# EAGLE design dice (EAGLE 9.6.0)
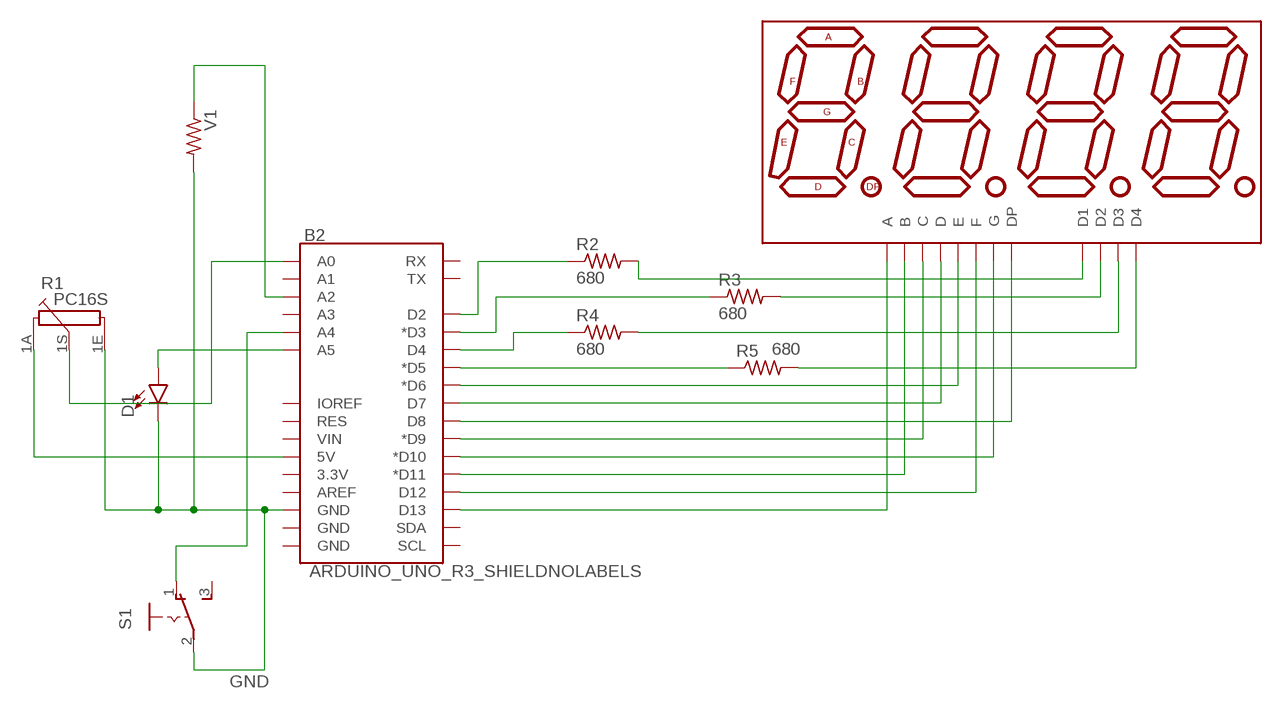
[diagram p0: schematic, sheet 1]

## Parts
B2  ARDUINO_UNO_R3_SHIELDNOLABELS  [UNO_R3_SHIELD_NOLABELS]
D1  LED5MM  [LED_5MM]
DISP1  ATA8041AB  7-SEGMENT-4DIGIT-20MM-BLUE  [7-SEGMENT-4DIGIT-20MM]
R1  PC16S  [PC16S]
R2  680  R-US_0204/7  [0204/7]
R3  680  R-US_0204/7  [0204/7]
R4  680  R-US_0204/7  [0204/7]
R5  680  R-US_0204/7  [0204/7]
S1  255SB  [255SB]
V1  R-US_0414/15  [0414/15]

## Nets
A: B2.D13 DISP1.11(A)
B: B2.D11(*D11) DISP1.7(B)
C: B2.D9(*D9) DISP1.4(C)
D: B2.D7 DISP1.2(D)
D1: DISP1.12(D1) R2.2
D1G: B2.D2 R2.1
D2: DISP1.9(D2) R3.2
D2G: B2.D3(*D3) R3.1
D3: DISP1.8(D3) R4.2
D3G: B2.D4 R4.1
D4: DISP1.6(D4) R5.2
D4G: B2.D5(*D5) R5.1
DP: B2.D8 DISP1.3(DP)
E: B2.D6(*D6) DISP1.1(E)
F: B2.D12 DISP1.10(F)
G: B2.D10(*D10) DISP1.5(G)
GND: B2.GND@2(GND) D1.K(C) R1.1E S1.2(P) V1.2
LED: B2.A5 D1.A
POT: B2.A0 R1.1S
SW: B2.A4 S1.1(O)
VCC: B2.5V R1.1A
VIBR: B2.A2 V1.1
Unconnected: B2.3.3V B2.A1 B2.A3 B2.AREF B2.GND@0(GND) B2.GND@1(GND) B2.IOREF B2.RES B2.RX B2.SCL B2.SDA B2.TX B2.VIN S1.3(S)

## Library data of the parts
B2 = SparkFun-Boards-mtr:ARDUINO_UNO_R3_SHIELD: Arduino R3 Shield Footprint Shield form compatible with the Arduino Uno R3. SparkFun Products: MG2639 Cellular Shield <https://www.sparkfun.com/products/13120> MIDI Shield <https://www.sparkfun.com/products/12898> R3 Stackable Headers Kit <https://www.sparkfun.com/products/11417>
D1 = SparkFun-LED:LED: LED (Generic) Standard schematic elements and footprints for 5mm, 3mm, 1206, and 0603 sized LEDs. Generic LEDs with no color specified.
DISP1 = SparkFun-LED-mtr:7-SEGMENT-4DIGIT-20MM: 4 Digit 7 Segment Display This is a part for the 4-Digit 7-segment LEDs from Young Sun. Different from the Digikey LEDs, all 16 pins are used. The LONGPADS Variant is used for a test jig, but you may like it because there is more pad to solder to. If you are concerned about routing space, the standard works just fine though. Datasheets: Red <http://cdn.sparkfun.com/datasheets/Components/LED/1LEDREDCC.pdf> Yellow <http://cdn.sparkfun.com/datasheets/Components/LED/1LEDYELCC.pdf> Green <http://cdn.sparkfun.com/datasheets/Components/LED/1LEDGRNCC.pdf> Blue <http://cdn.sparkfun.com/datasheets/Components/LED/1LEDBLUCC.pdf> White <http://cdn.sparkfun.com/datasheets/Components/LED/1LEDWHTCC.pdf> SparkFun Products Raw Components 7-Segment Display - 20mm (Red) <https://www.sparkfun.com/products/11405> (COM-11405) 7-Segment Display - 20mm (Yellow) <https://www.sparkfun.com/products/11406> (COM-11406) 7-Segment Display - 20mm (Green) <https://www.sparkfun.com/products/11407> (COM-11407) 7-Segment Display - 20mm (Blue) <https://www.sparkfun.com/products/11408> (COM-11408) 7-Segment Display - 20mm (White) <https://www.sparkfun.com/products/11409> (COM-11409) Serial Controlled SparkFun OpenSegment Serial Display - 20mm (Red) <https://www.sparkfun.com/products/11644> (COM-11644) SparkFun OpenSegment Serial Display - 20mm (Yellow) <https://www.sparkfun.com/products/11645> (COM-11645) SparkFun OpenSegment Serial Display - 20mm (Green) <https://www.sparkfun.com/products/11646> (COM-11646) SparkFun OpenSegment Serial Display - 20mm (Blue) <https://www.sparkfun.com/products/11647> (COM-11647) SparkFun OpenSegment Serial Display - 20mm (White) <https://www.sparkfun.com/products/11648> (COM-11648) Other SparkFun OpenSegment Shield <https://www.sparkfun.com/products/13190> (DEV-13190); PROD_ID: COMP-11446
R1 = piher:PC16S: POTENTIOMETER single carbon potentiometer, 16 mm, S3ROH; OC_FARNELL: 4452940; OC_NEWARK: unknown
R2-R5 V1 = rcl:R-US_: RESISTOR, American symbol; SPICEPREFIX: R
S1 = switch:255SB: SLIDING SWITCH Distributor Buerklin, 11G810

## Board
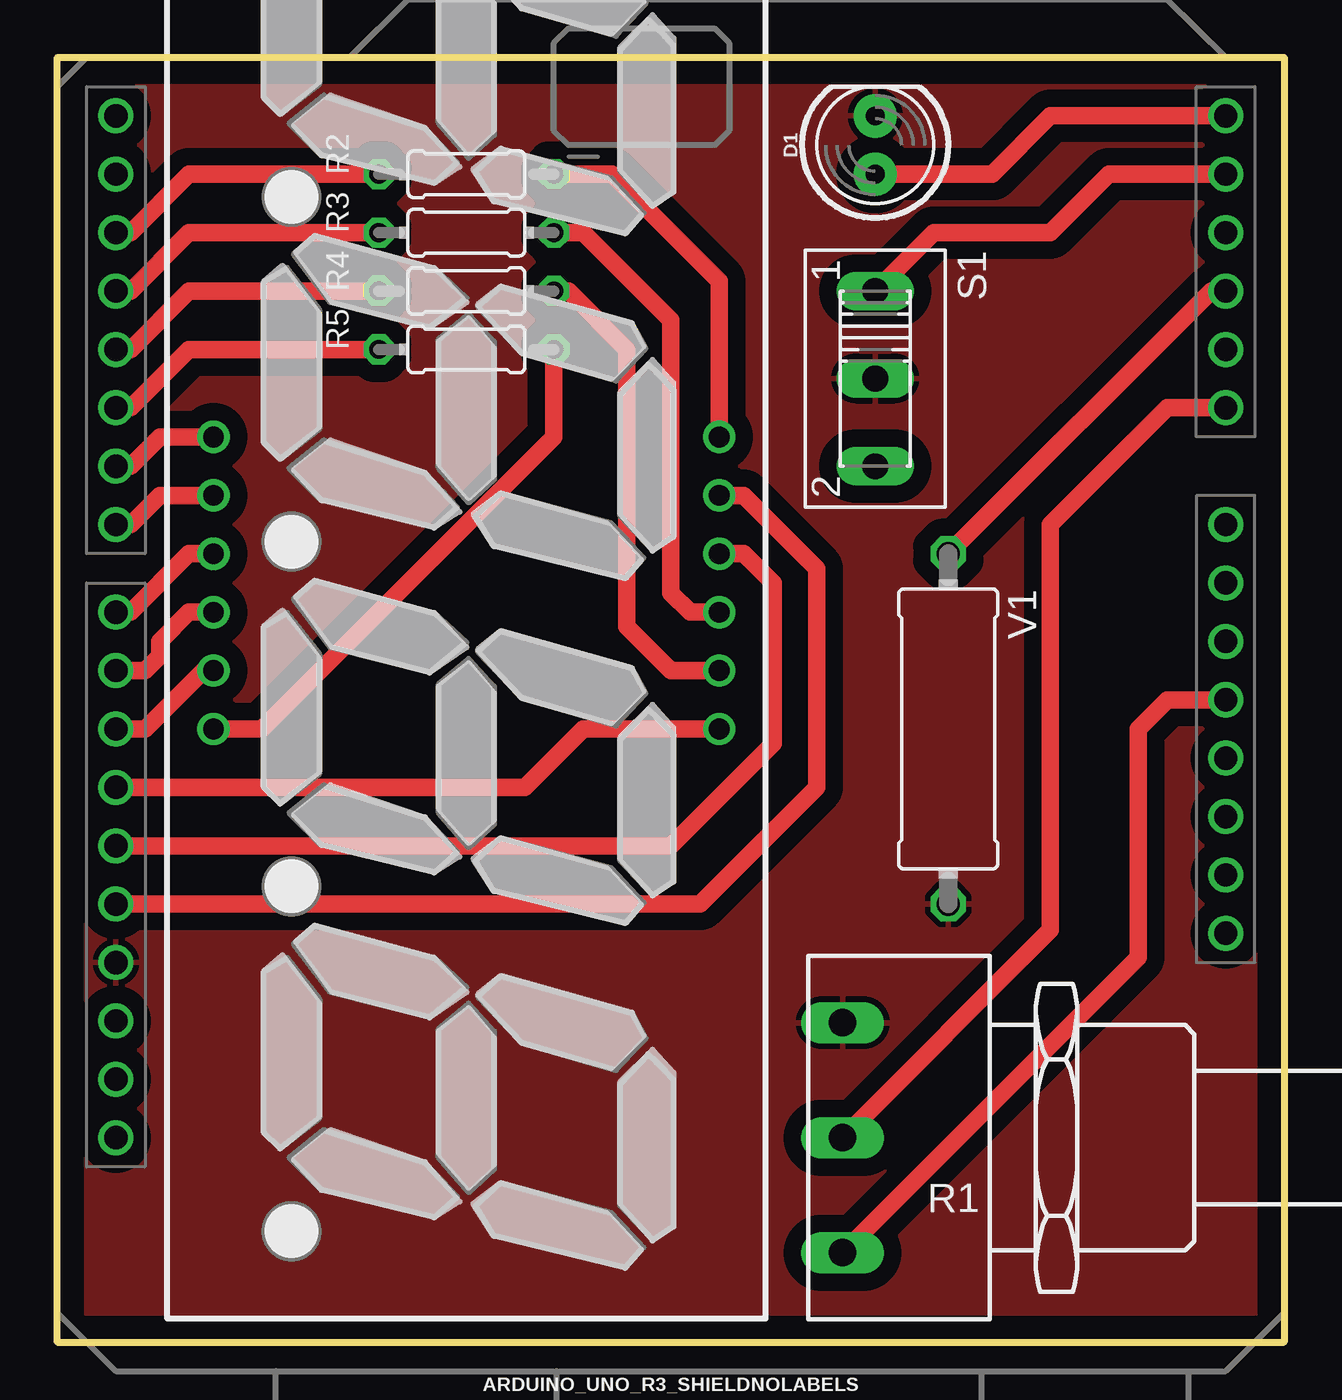
[diagram p1: board, top side]
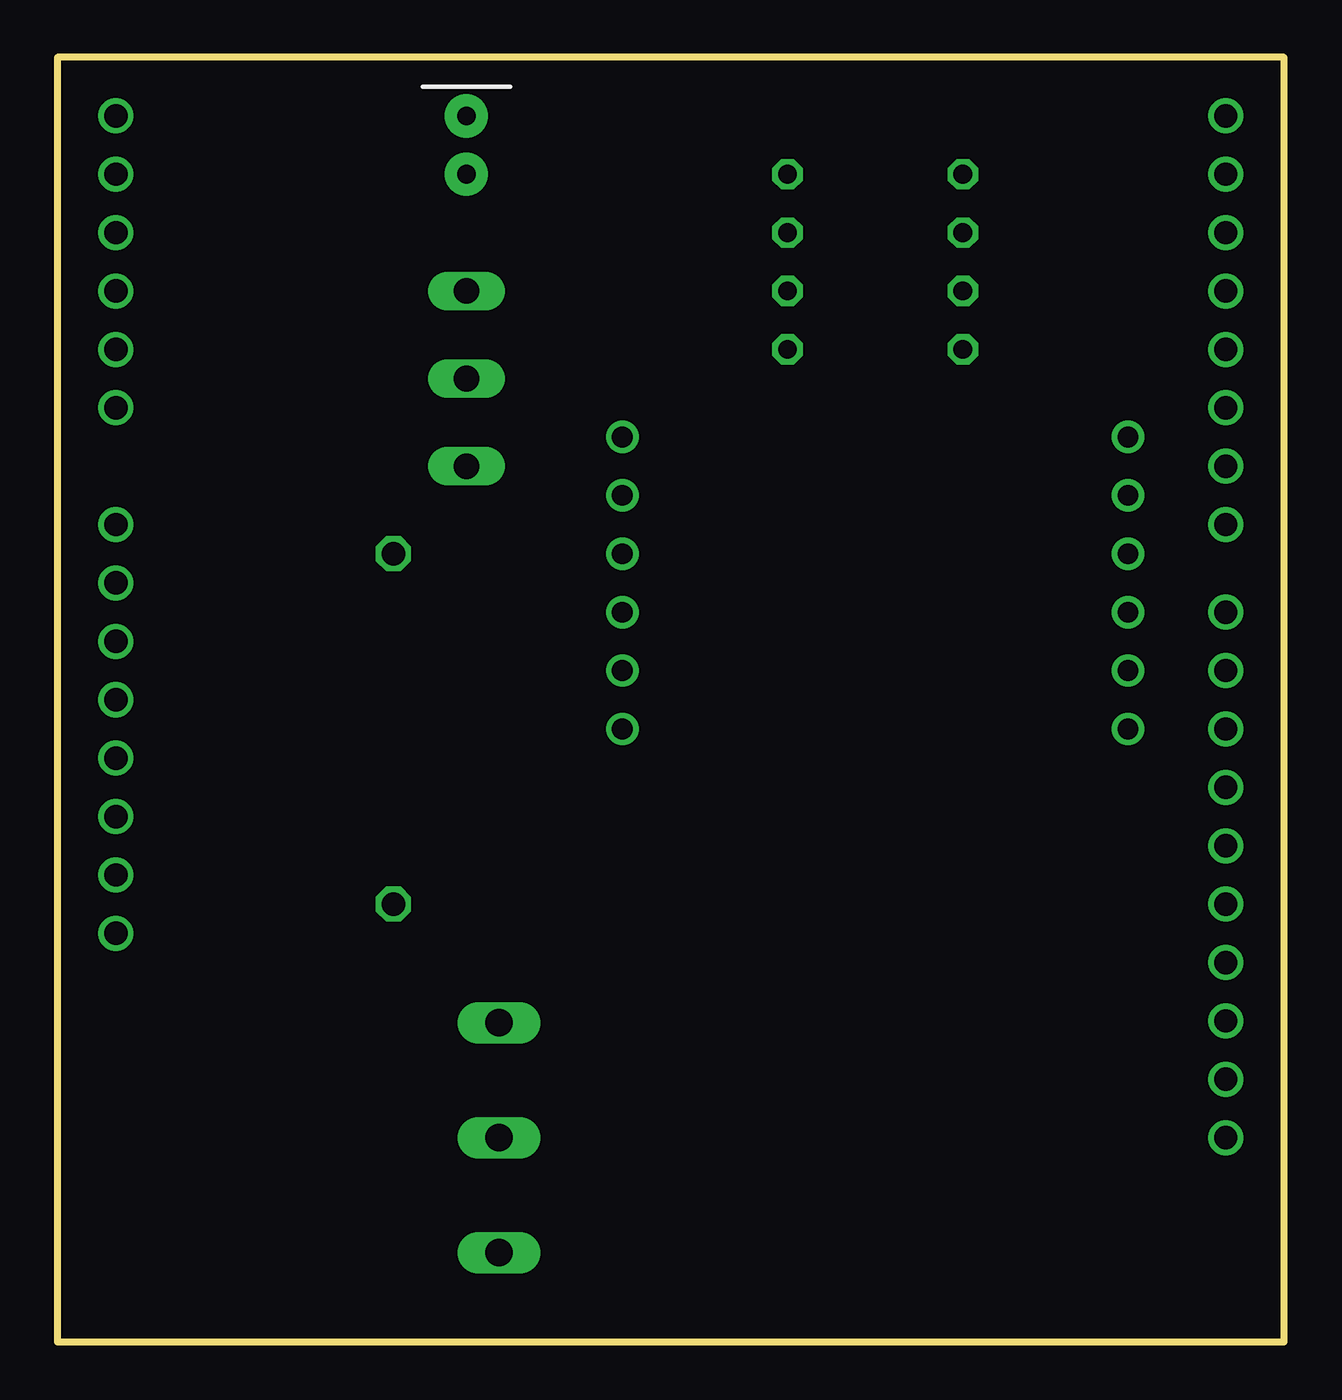
[diagram p2: board, bottom side, seen from below]

Size 53.34 x 55.88 mm. Coordinates in mm from the lower left corner, seen from the top.
Outline: 0,0 53.34,0 53.34,55.88 0,55.88 0,0
Copper layers 1: Top 0.035mm
Design rules "default *": minimum track width 30mil, minimum drill 20mil, track to track 30mil, track to pad 12mil, pad to pad 12mil, via to via 12mil, smd to smd 12mil, copper to edge 40mil, drill to drill 12mil, minimum pad ring 10mil, minimum via ring 8mil, stop-mask expansion 4mil, vias tented up to drill 25mil, thermal gap 10mil

### Footprints (pad centres in the part's own frame; a part is rotated, then mirrored left to right if it is on the bottom)
UNO_R3_SHIELD_NOLABELS = drill 1.016 pad 0.94: 3.3V 24.13,-3.81; 5V 24.13,-1.27; A0 24.13,11.43; A1 24.13,13.97; A2 24.13,16.51; A3 24.13,19.05; A4 24.13,21.59; A5 24.13,24.13; AREF -24.13,-15.24; D2 -24.13,19.05; D3 -24.13,16.51; D4 -24.13,13.97; D5 -24.13,11.43; D6 -24.13,8.89; D7 -24.13,6.35; D8 -24.13,2.54; D9 -24.13,0; D10 -24.13,-2.54; D11 -24.13,-5.08; D12 -24.13,-7.62; D13 -24.13,-10.16; GND@0 24.13,1.27; GND@1 24.13,3.81; GND@2 -24.13,-12.7; IOREF 24.13,-8.89; NC 24.13,-11.43; RES 24.13,-6.35; RX -24.13,24.13; SCL -24.13,-20.32; SDA -24.13,-17.78; TX -24.13,21.59; VIN 24.13,6.35
LED_5MM = drill 0.813 pad 1.88: A -1.27,0; K 1.27,0
7-SEGMENT-4DIGIT-20MM = drill 0.9 pad 0.94: 1 -6.35,-10.998; 2 -3.81,-10.998; 3 -1.27,-10.998; 4 1.27,-10.998; 5 3.81,-10.998; 6 6.35,-10.998; 7 6.35,10.998; 8 3.81,10.998; 9 1.27,10.998; 10 -1.27,10.998; 11 -3.81,10.998; 12 -6.35,10.998
PC16S = drill 1.2 long: 1A -5,6.5; 1E 5,6.5; 1S 0,6.5
0204/7 = drill 0.813 octagon: 1 -3.81,0; 2 3.81,0
255SB = drill 1.118 long: 1 -3.81,0; 2 0,0; 3 3.81,0
0414/15 = drill 1.016 octagon: 1 -7.62,0; 2 7.62,0

### Placement (x,y rotation side)
B2  26.67,29.21 0 top
D1  35.56,52.07 90 top
DISP1  17.78,33.02 270 top
R1  40.64,8.89 90 top
R2  17.78,50.8 0 top
R3  17.78,48.26 0 top
R4  17.78,45.72 0 top
R5  17.78,43.18 0 top
S1  35.56,41.91 270 top
V1  38.73,26.67 270 top

### Tracks (layer width: path | path; a pad name or v marks a point on that pad's centre or on a via)
A
  Top 0.762: B2.D13 27.94,19.05 33.02,24.13 33.02,33.66 29.84,36.83 DISP1.11
B
  Top 0.762: B2.D11 20.32,24.13 22.86,26.67 DISP1.7
C
  Top 0.762: B2.D9 3.81,29.21 4.45,29.84 4.45,30.48 5.71,31.75 DISP1.4
D
  Top 0.762: B2.D7 3.17,35.56 4.45,36.83 DISP1.2
D1
  Top 0.762: R2.2 24.13,50.8 28.78,46.15 DISP1.12
D1G
  Top 0.762: B2.D2 3.17,48.26 5.71,50.8 R2.1
D2
  Top 0.762: R3.2 22.86,48.26 26.67,44.45 26.67,32.59 27.51,31.75 DISP1.9
D2G
  Top 0.762: B2.D3 3.17,45.72 5.71,48.26 R3.1
D3
  Top 0.762: R4.2 22.23,45.72 24.77,43.18 24.77,31.11 26.67,29.21 DISP1.8
D3G
  Top 0.762: B2.D4 3.17,43.18 5.71,45.72 R4.1
D4
  Top 0.762: DISP1.6 8.89,26.67 21.59,39.37 R5.2
D4G
  Top 0.762: B2.D5 3.17,40.64 5.71,43.18 R5.1
DP
  Top 0.762: B2.D8 3.17,31.75 5.71,34.29 DISP1.3
E
  Top 0.762: B2.D6 3.17,38.1 4.45,39.37 DISP1.1
F
  Top 0.762: B2.D12 26.67,21.59 31.11,26.04 31.11,33.02 29.84,34.29 DISP1.10
G
  Top 0.762: B2.D10 3.81,26.67 6.35,29.21 DISP1.5
GND
  pour Top: 0,55.88 53.34,55.88 53.34,0 0,0
LED
  Top 0.762: D1.A 40.64,50.8 43.18,53.34 B2.A5
POT
  Top 0.762: R1.1S 43.18,17.93 43.18,35.56 48.26,40.64 B2.A0
SW
  Top 0.762: S1.1 38.1,48.26 43.18,48.26 45.72,50.8 B2.A4
VCC
  Top 0.762: R1.1A 46.99,16.74 46.99,26.67 48.26,27.94 B2.5V
VIBR
  Top 0.762: V1.1 50.16,45.72 B2.A2